# EAGLE design lin.reg.schematic_forpcb (EAGLE 8.4.0)
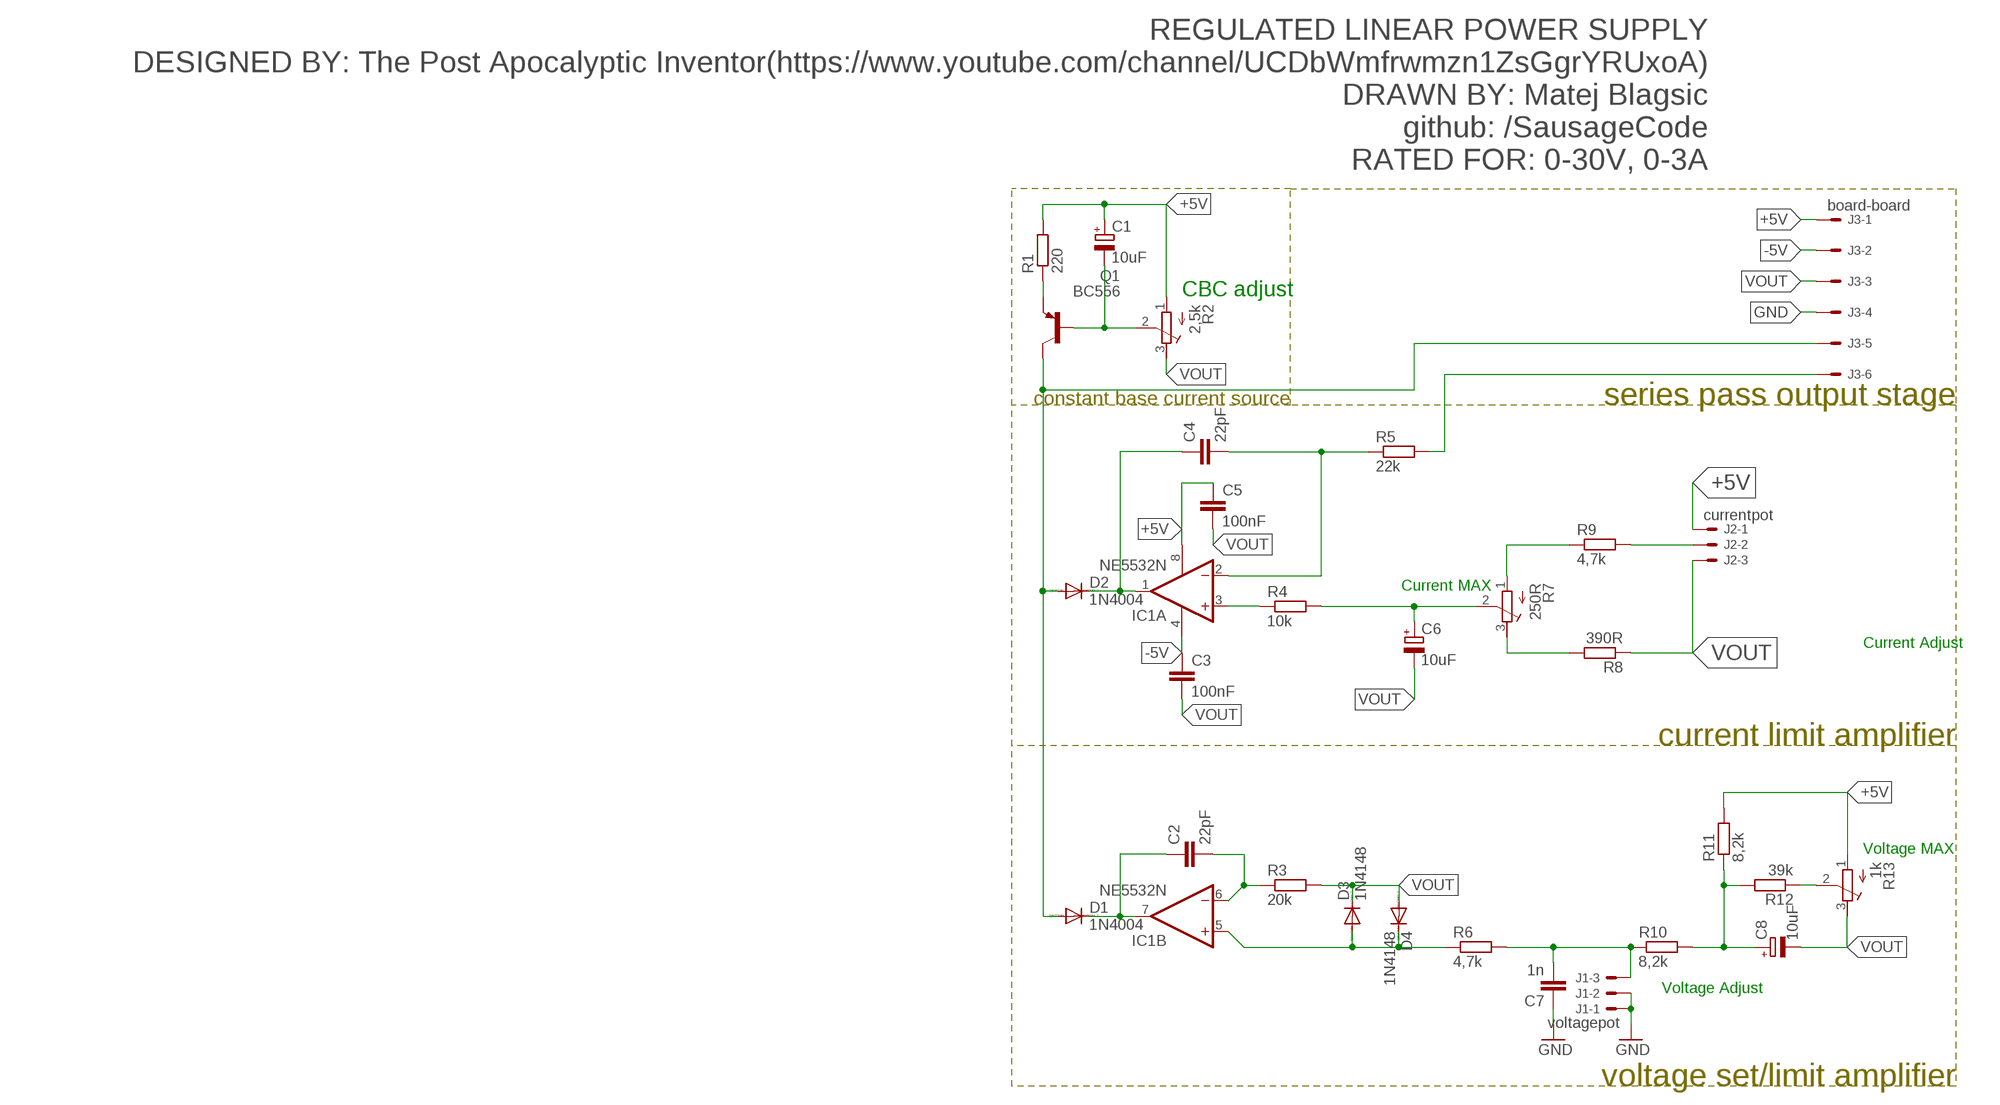
[diagram p0: schematic, sheet 1]

## Parts
C1  10uF  CPOL-EUE2.5-5  [E2,5-5]
C2  22pF  C-EU025-025X050  [C025-025X050]
C3  100nF  C-EU025-025X050  [C025-025X050]
C4  22pF  C-EU025-025X050  [C025-025X050]
C5  100nF  C-EU025-025X050  [C025-025X050]
C6  10uF  CPOL-EUE2.5-5  [E2,5-5]
C7  1n  C-EU025-025X050  [C025-025X050]
C8  10uF  CPOL-EUE2.5-5  [E2,5-5]
D1  1N4004  [DO41-10]
D2  1N4004  [DO41-10]
D3  1N4148  1N4004  [DO41-10]
D4  1N4148  1N4004  [DO41-10]
IC1  NE5532N  [DIL08]
J1  voltagepot  22-27-2031-03  [6410-03]
J2  currentpot  22-27-2031-03  [6410-03]
J3  board-board  22-27-2061-06  [6410-06]
Q1  BC556  [TO92-EBC]
R1  220  R-EU_0207/10  [0207/10]
R2  2,5k  R-TRIMM64W  [RTRIM64W]
R3  20k  R-EU_0207/10  [0207/10]
R4  10k  R-EU_0207/10  [0207/10]
R5  22k  R-EU_0207/10  [0207/10]
R6  4,7k  R-EU_0207/10  [0207/10]
R7  250R  R-TRIMM64W  [RTRIM64W]
R8  390R  R-EU_0207/10  [0207/10]
R9  4,7k  R-EU_0207/10  [0207/10]
R10  8,2k  R-EU_0207/10  [0207/10]
R11  8,2k  R-EU_0207/10  [0207/10]
R12  39k  R-EU_0207/10  [0207/10]
R13  1k  R-TRIMM64W  [RTRIM64W]

## Nets
+5V: C1.+ C5.1 IC1.8(P:V+) J2.1 J3.1 R1.2 R2.1(A) R11.2 R13.1(A)
-5V: C3.1 IC1.4(P:V-) J3.2
GND: C7.1 J1.1 J1.2 J3.4
N$1: C1.- Q1.B R2.2(S)
N$2: Q1.E R1.1
N$3: R7.1(A) R9.1
N$4: C4.1 D2.C IC1.1(A:OUT)
N$5: C2.1 D1.C IC1.7(B:OUT)
N$6: D1.A D2.A J3.5 Q1.C
N$8: C2.2 IC1.6(B:-IN) R3.1
N$9: IC1.3(A:+IN) R4.1
N$10: D3.A D4.C IC1.5(B:+IN) R6.1
N$11: R7.3(E) R8.2
N$13: J2.2 R9.2
N$16: C6.+ R4.2 R7.2(S)
N$17: C4.2 IC1.2(A:-IN) R5.1
N$19: C7.2 J1.3 R6.2 R10.1
N$20: C8.+ R10.2 R11.1 R12.2
N$22: R12.1 R13.2(S)
N$24: J3.6 R5.2
VOUT: C3.2 C5.2 C6.- C8.- D3.C D4.A J2.3 J3.3 R2.3(E) R3.2 R8.1 R13.3(E)

## Notes on the sheet
- REGULATED LINEAR POWER SUPPLY
  DESIGNED BY: The Post Apocalyptic Inventor(https://www.youtube.com/channel/UCDbWmfrwmzn1ZsGgrYRUxoA)
  DRAWN BY: Matej Blagsic
  github: /SausageCode
  RATED FOR: 0-30V, 0-3A
- CBC adjust
- constant base current source | series pass output stage
- Current MAX
- Current Adjust
- current limit amplifier
- Voltage MAX
- Voltage Adjust
- voltage set/limit amplifier

## Library data of the parts
C1 C6 C8 = rcl:CPOL-EU: POLARIZED CAPACITOR, European symbol
C2-C5 C7 = rcl:C-EU: CAPACITOR, European symbol
D1-D4 = diode:1N4004: DIODE general purpose rectifier, 1 A
IC1 = linear:NE5532: AUDIO AMPLIFIER
J1 J2 = con-molex:22-?-03: CONNECTOR wire to board 2.54 mm (.1 inch) pitch header; OC_FARNELL: unknown; OC_NEWARK: unknown
J3 = con-molex:22-?-06: CONNECTOR wire to board 2.54 mm (.1 inch) pitch header; OC_FARNELL: unknown; OC_NEWARK: unknown
Q1 = transistor-pnp:BC556*: PNP Transistror
R1 R3-R6 R10-R12 = rcl:R-EU_: RESISTOR, European symbol
R2 R7 R13 = rcl:R-TRIMM: Trimm resistor
R8 R9 = resistor:R-EU_: RESISTOR, European symbol

## Board
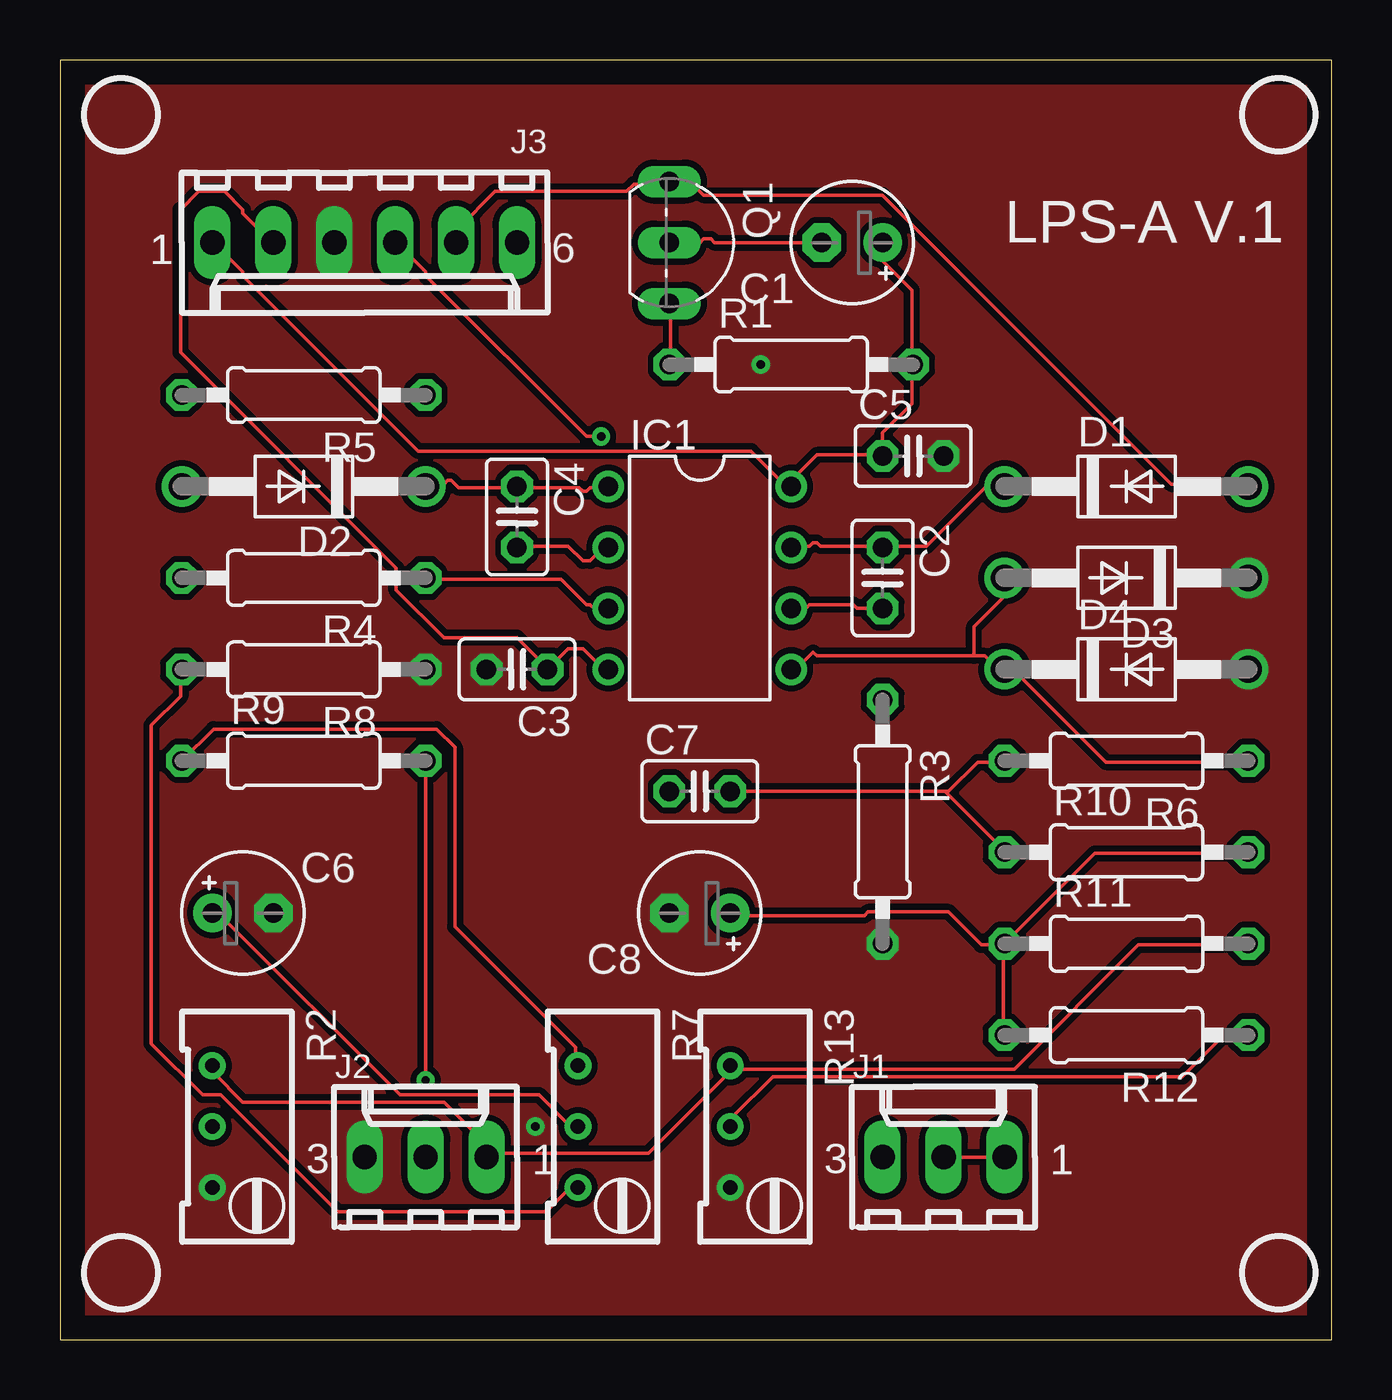
[diagram p1: board, top side]
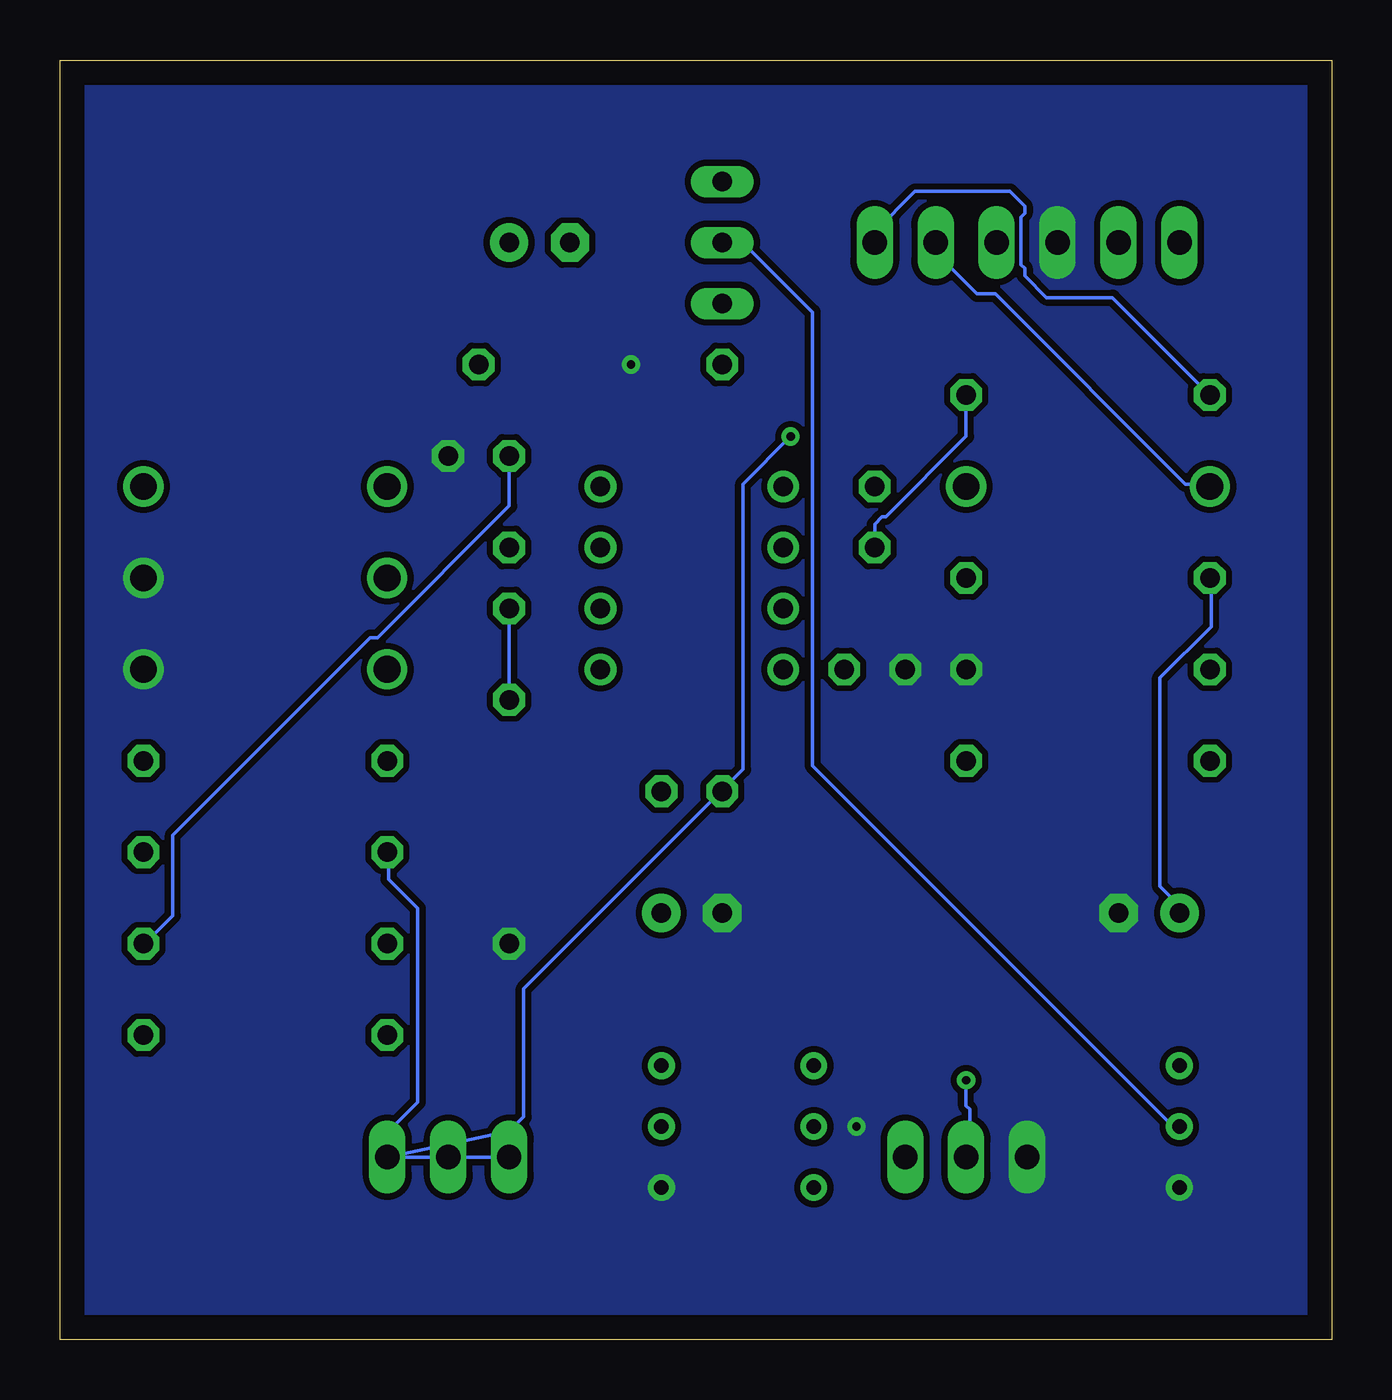
[diagram p2: board, bottom side, seen from below]

Size 53.01 x 53.33 mm. Coordinates in mm from the lower left corner, seen from the top.
Outline: 0,0 53.01,0 53.01,53.33 0,53.33 0,0
Copper layers (1*16): Top 0.035mm / dielectric 1.5mm / Bottom 0.035mm
Design rules "default *": minimum track width 6mil, minimum drill 0.35mm, track to track 10mil, track to pad 10mil, pad to pad 10mil, via to via 10mil, smd to smd 6mil, copper to edge 40mil, drill to drill 6mil, minimum pad ring 10mil, minimum via ring 8mil, stop-mask expansion 4mil, vias tented up to drill 0mil, thermal gap 0mil

### Footprints (pad centres in the part's own frame; a part is rotated, then mirrored left to right if it is on the bottom)
E2,5-5 = drill 0.813 pad 1.6: + -1.27,0 | drill 0.813 pad 1.6 octagon: - 1.27,0
C025-025X050 = drill 0.813 octagon: 1 -1.27,0; 2 1.27,0
DO41-10 = drill 1.118: A 5.08,0; C -5.08,0
DIL08 = drill 0.813 pad 1.27: 1 -3.81,-3.81; 2 -1.27,-3.81; 3 1.27,-3.81; 4 3.81,-3.81; 5 3.81,3.81; 6 1.27,3.81; 7 -1.27,3.81; 8 -3.81,3.81
6410-03 = drill 1.016 long: 1 2.54,0; 2 0,0; 3 -2.54,0
6410-06 = drill 1.016 long: 1 6.35,0; 2 3.81,0; 3 1.27,0; 4 -1.27,0; 5 -3.81,0; 6 -6.35,0
TO92-EBC = drill 0.813 long: B 0,-1.27; C -2.54,-1.27; E 2.54,-1.27
0207/10 = drill 0.813 octagon: 1 -5.08,0; 2 5.08,0
RTRIM64W = drill 0.61: 1 1.27,-2.54; 2 1.27,0; 3 1.27,2.54

### Placement (x,y rotation side)
C1  33.02,45.72 180 top
C2  34.29,31.75 270 top
C3  19.05,27.94 180 top
C4  19.05,34.29 270 top
C5  35.56,36.83 0 top
C6  7.62,17.78 0 top
C7  26.67,22.86 0 top
C8  26.67,17.78 180 top
D1  44.45,35.56 0 top
D2  10.16,35.56 180 top
D3  44.45,31.75 180 top
D4  44.45,27.94 0 top
IC1  26.67,31.75 270 top
J1  36.83,7.62 0 top
J2  15.24,7.62 0 top
J3  12.7,45.72 180 top
Q1  26.67,45.72 270 top
R1  30.48,40.64 0 top
R2  7.62,8.89 180 top
R3  34.29,21.59 270 top
R4  10.16,31.75 180 top
R5  10.16,39.37 180 top
R6  44.45,24.13 180 top
R7  22.86,8.89 180 top
R8  10.16,27.94 180 top
R9  10.16,24.13 0 top
R10  44.45,20.32 0 top
R11  44.45,16.51 0 top
R12  44.45,12.7 180 top
R13  29.21,8.89 180 top

### Tracks (layer width: path | path; a pad name or v marks a point on that pad's centre or on a via)
+5V
  Top 0.152: 30.48,35.66 30.79,35.97 30.79,36.12 31.55,36.88 34.29,36.88 | 34.29,36.88 34.29,37.8 35.51,39.01 35.51,40.54 R1.2 35.51,40.69 35.51,43.74 34.29,44.96 C1.+ | 34.29,36.88 C5.1 | 30.48,35.66 30.17,35.66 28.8,37.03 14.94,37.03 7.62,44.35 7.62,44.5 6.4,45.72 J3.1 | 30.48,35.66 IC1.8 | 17.68,7.77 17.68,7.62 J2.1 17.68,7.77 | 17.68,7.77 17.68,8.23 16,9.91 7.62,9.91 6.4,11.12 6.4,11.43 R2.1 | 27.89,11.28 27.89,11.12 24.54,7.77 17.68,7.77 | 27.89,11.28 27.89,11.43 R13.1 27.89,11.28 | 27.89,11.28 39.78,11.28 44.96,16.46 49.53,16.46 R11.2
  Bottom 0.152: C5.1 34.29,34.75 39.78,29.26 40.08,29.26 48.31,21.03 48.31,17.68 49.53,16.46 R11.2
-5V
  Top 0.152: IC1.4 22.86,28.04 22.55,28.04 21.79,28.8 21.18,28.8 C3.1 20.27,28.04 19.05,29.26 16,29.26 14.02,31.24 14.02,32.16 5.03,41.15 5.03,47.09 5.79,47.85 6.86,47.85 7.62,47.09 7.62,46.94 8.84,45.72 J3.2
GND  (via drill 0.35)
  Top 0.152: J1.1 J1.2 | v22.55,37.64 21.95,37.64 15.24,44.35 15.24,44.5 14.02,45.72 J3.4
  Bottom 0.152: 25.45,22.86 33.68,14.63 33.68,9.3 34.29,8.69 J1.1 | v22.55,37.64 24.54,35.66 24.54,23.77 25.45,22.86 | 25.45,22.86 C7.1
N$1
  Top 0.152: C1.- 27.28,45.72 27.13,45.87 26.82,45.87 26.67,45.72 Q1.B
  Bottom 0.152: Q1.B 24.54,45.72 21.64,42.82 21.64,23.93 6.71,8.99 6.4,8.99 R2.2
N$2
  Top 0.152: R1.1 25.45,40.69 25.45,43.13 Q1.E
N$3
  Top 0.152: R9.1 6.4,25.45 15.7,25.45 16.46,24.69 16.46,17.22 21.49,12.19 21.49,11.43 R7.1
N$4
  Top 0.152: 19.05,35.51 16.61,35.51 16.31,35.81 16.15,35.81 16,35.66 15.24,35.66 D2.C | 19.05,35.51 21.64,35.51 21.79,35.36 21.95,35.36 22.1,35.51 22.86,35.51 IC1.1 | 19.05,35.51 C4.1
N$5
  Top 0.152: 34.29,33.07 31.7,33.07 31.55,33.22 31.39,33.22 31.24,33.07 30.48,33.07 IC1.7 | 34.29,33.07 36.12,33.07 38.56,35.51 39.32,35.51 D1.C | 34.29,33.07 C2.1
N$6
  Top 0.152: J3.5 16.61,45.72 16.61,46.33 18.14,47.85 23.62,47.85 23.93,48.16 25.3,48.16 Q1.C 25.45,48.16 26.37,48.16 26.82,47.7 34.29,47.7 46.33,35.66 49.53,35.66 D1.A
  Bottom 0.152: D2.A 5.18,35.66 6.1,35.66 14.02,43.59 14.78,43.59 16.46,45.26 16.46,45.72 J3.5
N$8
  Top 0.152: IC1.6 31.09,30.48 31.24,30.63 33.07,30.63 33.22,30.48 C2.2
  Bottom 0.152: C2.2 R3.1
N$9
  Top 0.152: IC1.3 22.25,30.48 22.1,30.63 21.95,30.63 20.88,31.7 15.24,31.7 R4.1
N$10
  Top 0.152: 38.1,28.5 38.56,28.5 39.01,28.04 39.32,28.04 D4.C 39.47,27.89 39.78,27.89 43.59,24.08 49.53,24.08 R6.1 | 38.1,28.5 31.55,28.5 31.39,28.65 30.79,28.04 30.48,28.04 IC1.5 | 38.1,28.5 38.1,29.72 39.32,30.94 39.32,31.7 D3.A
N$11
  Top 0.152: R7.3 21.49,6.25 21.18,6.25 20.27,5.33 11.58,5.33 6.71,10.21 5.94,10.21 3.81,12.34 3.81,25.6 5.03,26.82 5.03,27.89 R8.2
N$13  (via drill 0.35)
  Top 0.152: v15.24,10.82 R9.2
  Bottom 0.152: v15.24,10.82 15.24,9.75 15.09,9.6 15.09,7.77 J2.2
N$16
  Top 0.152: R7.2 21.49,8.99 21.18,8.99 19.96,10.21 14.17,10.21 6.71,17.68 6.4,17.68 C6.+
  Bottom 0.152: R4.2 5.03,31.7 5.03,29.72 7.16,27.58 7.16,18.9 6.4,18.14 6.4,17.83 C6.+
N$17
  Top 0.152: C4.2 19.05,33.07 21.18,33.07 21.79,32.46 22.1,32.46 22.55,32.92 22.86,32.92 IC1.2
  Bottom 0.152: R5.1 15.24,37.64 18.59,34.29 18.74,34.29 19.05,33.98 C4.2
N$19
  Top 0.152: 36.88,22.86 37.03,22.86 38.25,24.08 39.32,24.08 R6.2 | 36.88,22.86 C7.2 | 36.88,22.86 39.32,20.42 R10.1
  Bottom 0.152: J1.3 39.32,7.62 39.32,8.69 38.1,9.91 38.1,17.98 39.32,19.2 39.32,20.27 R10.1
N$20
  Top 0.152: 39.32,16.46 39.32,12.8 R12.2 | R10.2 49.53,20.27 43.13,20.27 R11.1 39.32,16.46 | 39.32,16.46 38.41,16.46 37.03,17.83 33.68,17.83 33.53,17.68 28.04,17.68 C8.+
N$22
  Top 0.152: R13.2 28.04,8.99 28.04,9.3 29.72,10.97 46.79,10.97 48.46,12.65 49.53,12.65 R12.1
N$24
  Bottom 0.152: R5.2 9.14,43.43 11.89,43.43 12.8,44.35 12.8,44.65 12.95,44.81 12.95,46.79 12.8,46.94 12.8,47.24 13.41,47.85 17.37,47.85 19.05,46.18 J3.6
VOUT  (via drill 0.35)
  other vias: 29.21,40.64 19.81,8.89
  pour Bottom: 0,53.34 53.34,53.34 53.34,0 0,0
  pour Top: 0,53.34 53.34,53.34 53.34,0 0,0

### Text on the board
tPlace: LPS-A V.1